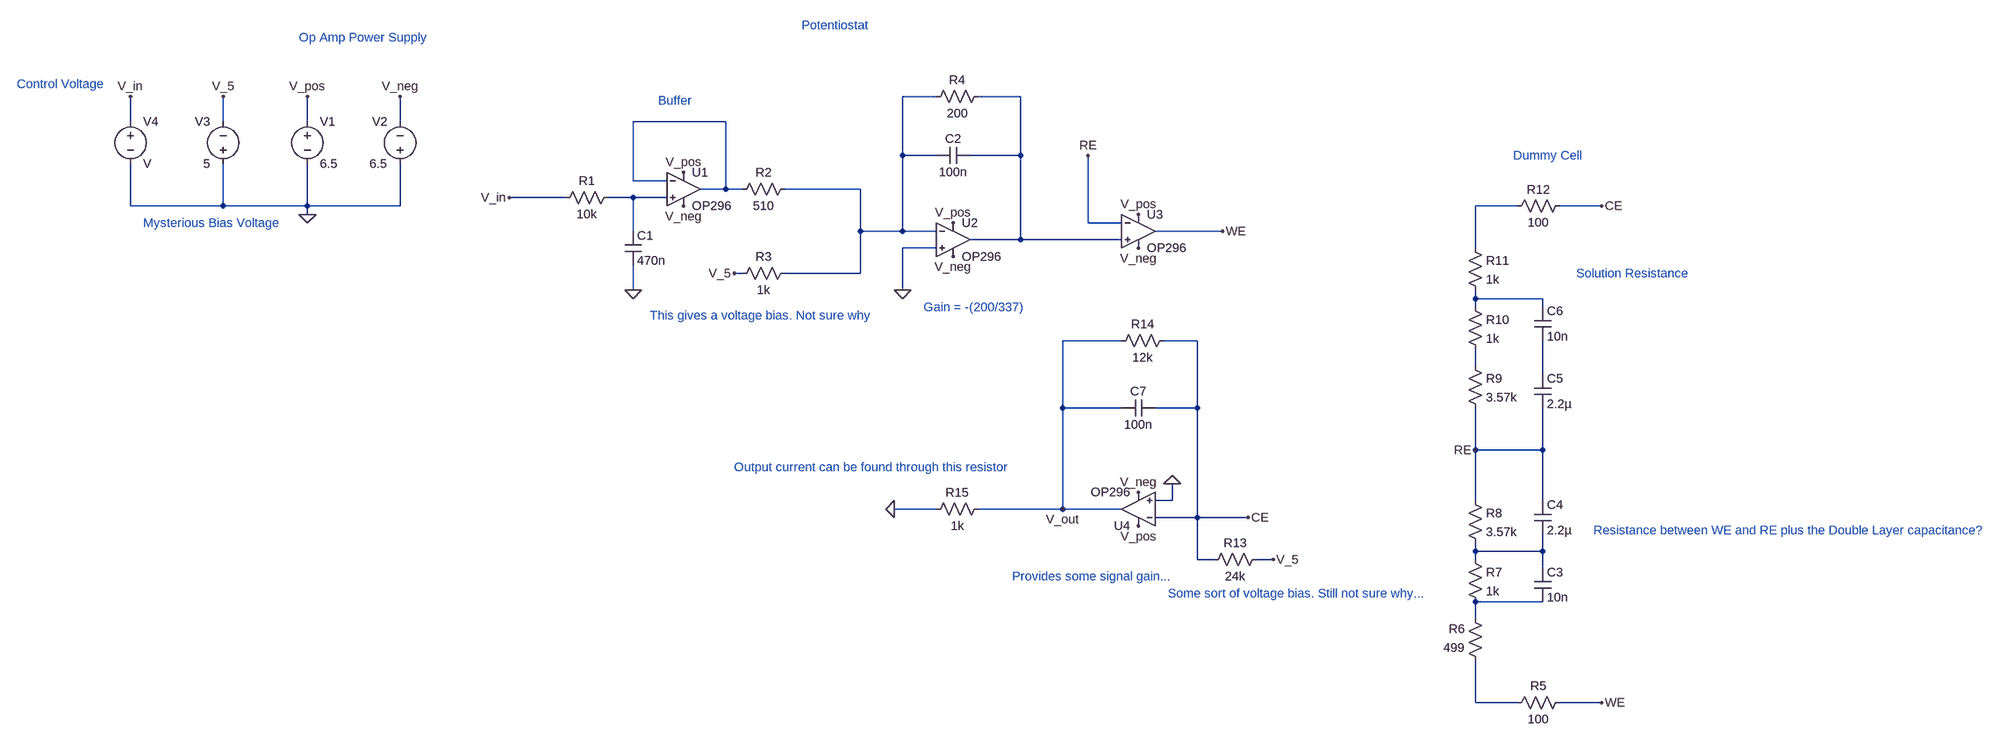
[diagram p0: schematic ECHM_potentiostat_1.asc]
ECHM_potentiostat_1.asc, the LTspice schematic file:
Version 4
SHEET 1 2912 972
WIRE 848 -240 784 -240
WIRE 1008 -240 928 -240
WIRE -816 -192 -816 -240
WIRE -640 -192 -640 -240
WIRE -480 -192 -480 -240
WIRE -304 -192 -304 -240
WIRE 448 -192 272 -192
WIRE 784 -128 784 -240
WIRE 848 -128 784 -128
WIRE 1008 -128 1008 -240
WIRE 1008 -128 912 -128
WIRE 272 -80 272 -192
WIRE 336 -80 272 -80
WIRE 448 -64 448 -192
WIRE 448 -64 400 -64
WIRE 480 -64 448 -64
WIRE 704 -64 560 -64
WIRE 144 -48 32 -48
WIRE 272 -48 224 -48
WIRE 336 -48 272 -48
WIRE -816 -32 -816 -112
WIRE -640 -32 -640 -112
WIRE -640 -32 -816 -32
WIRE -480 -32 -480 -112
WIRE -480 -32 -640 -32
WIRE -304 -32 -304 -112
WIRE -304 -32 -480 -32
WIRE 1952 -32 1872 -32
WIRE 2112 -32 2032 -32
WIRE -480 -16 -480 -32
WIRE 1136 0 1136 -128
WIRE 1200 0 1136 0
WIRE 272 16 272 -48
WIRE 704 16 704 -64
WIRE 784 16 784 -128
WIRE 784 16 704 16
WIRE 848 16 784 16
WIRE 1392 16 1264 16
WIRE 1008 32 1008 -128
WIRE 1008 32 912 32
WIRE 1200 32 1008 32
WIRE 848 48 784 48
WIRE 1872 48 1872 -32
WIRE 480 96 464 96
WIRE 704 96 704 16
WIRE 704 96 560 96
WIRE 272 128 272 80
WIRE 784 128 784 48
WIRE 1872 144 1872 128
WIRE 2000 144 1872 144
WIRE 1872 160 1872 144
WIRE 2000 160 2000 144
WIRE 1200 224 1088 224
WIRE 1344 224 1280 224
WIRE 1872 272 1872 240
WIRE 2000 288 2000 224
WIRE 1088 352 1088 224
WIRE 1200 352 1088 352
WIRE 1344 352 1344 224
WIRE 1344 352 1264 352
WIRE 1872 432 1872 352
WIRE 2000 432 2000 352
WIRE 2000 432 1872 432
WIRE 1296 528 1296 496
WIRE 1296 528 1264 528
WIRE 1872 528 1872 432
WIRE 2000 528 2000 432
WIRE 848 544 768 544
WIRE 1088 544 1088 352
WIRE 1088 544 928 544
WIRE 1200 544 1088 544
WIRE 1344 560 1344 352
WIRE 1344 560 1264 560
WIRE 1440 560 1344 560
WIRE 1872 624 1872 608
WIRE 2000 624 2000 592
WIRE 2000 624 1872 624
WIRE 1344 640 1344 560
WIRE 1376 640 1344 640
WIRE 1488 640 1456 640
WIRE 1872 640 1872 624
WIRE 2000 656 2000 624
WIRE 2000 720 1872 720
WIRE 1872 752 1872 720
WIRE 1872 912 1872 832
WIRE 1952 912 1872 912
WIRE 2112 912 2032 912
FLAG 32 -48 V_in
FLAG 272 128 0
FLAG -480 -240 V_pos
FLAG -304 -240 V_neg
FLAG 368 -32 V_neg
FLAG 368 -96 V_pos
FLAG 464 96 V_5
FLAG -640 -240 V_5
FLAG -480 -16 0
FLAG 880 0 V_pos
FLAG 880 64 V_neg
FLAG 784 128 0
FLAG 1232 -16 V_pos
FLAG 1232 48 V_neg
FLAG 1136 -128 RE
FLAG 1392 16 WE
FLAG 2112 912 WE
FLAG 2112 -32 CE
FLAG 1872 432 RE
FLAG 1232 576 V_pos
FLAG 1232 512 V_neg
FLAG 1488 640 V_5
FLAG 1440 560 CE
FLAG 768 544 0
FLAG -816 -240 V_in
FLAG 1088 544 V_out
FLAG 1296 496 0
SYMBOL res 240 -64 R90
WINDOW 0 0 56 VBottom 2
WINDOW 3 32 56 VTop 2
SYMATTR InstName R1
SYMATTR Value 10k
SYMBOL OpAmps\\OP296 368 -128 R0
SYMATTR InstName U1
SYMBOL cap 256 16 R0
SYMATTR InstName C1
SYMATTR Value 470n
SYMBOL voltage -480 -208 R0
WINDOW 123 0 0 Left 0
WINDOW 39 0 0 Left 0
SYMATTR InstName V1
SYMATTR Value 6.5
SYMBOL voltage -304 -96 R180
WINDOW 0 24 96 Left 2
WINDOW 3 24 16 Left 2
WINDOW 123 0 0 Left 0
WINDOW 39 0 0 Left 0
SYMATTR InstName V2
SYMATTR Value 6.5
SYMBOL res 576 -80 R90
WINDOW 0 0 56 VBottom 2
WINDOW 3 32 56 VTop 2
SYMATTR InstName R2
SYMATTR Value 510
SYMBOL res 576 80 R90
WINDOW 0 0 56 VBottom 2
WINDOW 3 32 56 VTop 2
SYMATTR InstName R3
SYMATTR Value 1k
SYMBOL voltage -640 -96 R180
WINDOW 0 24 96 Left 2
WINDOW 3 24 16 Left 2
WINDOW 123 0 0 Left 0
WINDOW 39 0 0 Left 0
SYMATTR InstName V3
SYMATTR Value 5
SYMBOL OpAmps\\OP296 880 -32 R0
SYMATTR InstName U2
SYMBOL cap 912 -144 R90
WINDOW 0 0 32 VBottom 2
WINDOW 3 32 32 VTop 2
SYMATTR InstName C2
SYMATTR Value 100n
SYMBOL res 944 -256 R90
WINDOW 0 0 56 VBottom 2
WINDOW 3 32 56 VTop 2
SYMATTR InstName R4
SYMATTR Value 200
SYMBOL OpAmps\\OP296 1232 -48 R0
SYMATTR InstName U3
SYMBOL res 2048 896 R90
WINDOW 0 0 56 VBottom 2
WINDOW 3 32 56 VTop 2
SYMATTR InstName R5
SYMATTR Value 100
SYMBOL res 1888 848 R180
WINDOW 0 36 76 Left 2
WINDOW 3 36 40 Left 2
SYMATTR InstName R6
SYMATTR Value 499
SYMBOL res 1856 624 R0
SYMATTR InstName R7
SYMATTR Value 1k
SYMBOL res 1856 512 R0
SYMATTR InstName R8
SYMATTR Value 3.57k
SYMBOL res 1856 256 R0
SYMATTR InstName R9
SYMATTR Value 3.57k
SYMBOL res 1856 144 R0
SYMATTR InstName R10
SYMATTR Value 1k
SYMBOL res 1856 32 R0
SYMATTR InstName R11
SYMATTR Value 1k
SYMBOL cap 1984 656 R0
SYMATTR InstName C3
SYMATTR Value 10n
SYMBOL cap 1984 528 R0
SYMATTR InstName C4
SYMATTR Value 2.2µ
SYMBOL cap 1984 288 R0
SYMATTR InstName C5
SYMATTR Value 2.2µ
SYMBOL cap 1984 160 R0
SYMATTR InstName C6
SYMATTR Value 10n
SYMBOL res 2048 -48 R90
WINDOW 0 0 56 VBottom 2
WINDOW 3 32 56 VTop 2
SYMATTR InstName R12
SYMATTR Value 100
SYMBOL OpAmps\\OP296 1232 608 R180
SYMATTR InstName U4
SYMBOL res 1472 624 R90
WINDOW 0 0 56 VBottom 2
WINDOW 3 32 56 VTop 2
SYMATTR InstName R13
SYMATTR Value 24k
SYMBOL cap 1264 336 R90
WINDOW 0 0 32 VBottom 2
WINDOW 3 32 32 VTop 2
SYMATTR InstName C7
SYMATTR Value 100n
SYMBOL res 1296 208 R90
WINDOW 0 0 56 VBottom 2
WINDOW 3 32 56 VTop 2
SYMATTR InstName R14
SYMATTR Value 12k
SYMBOL res 944 528 R90
WINDOW 0 0 56 VBottom 2
WINDOW 3 32 56 VTop 2
SYMATTR InstName R15
SYMATTR Value 1k
SYMBOL voltage -816 -208 R0
SYMATTR InstName V4
TEXT 1944 -128 Left 2 ;Dummy Cell
TEXT 592 -376 Left 2 ;Potentiostat
TEXT 320 -232 Left 2 ;Buffer
TEXT 304 176 Left 2 ;This gives a voltage bias. Not sure why
TEXT 824 160 Left 2 ;Gain = -(200/337)
TEXT 2064 96 Left 2 ;Solution Resistance
TEXT 2096 584 Left 2 ;Resistance between WE and RE plus the Double Layer capacitance?
TEXT 1288 704 Left 2 ;Some sort of voltage bias. Still not sure why...
TEXT 992 672 Left 2 ;Provides some signal gain...
TEXT 464 464 Left 2 ;Output current can be found through this resistor
TEXT -496 -352 Left 2 ;Op Amp Power Supply
TEXT -1032 -264 Left 2 ;Control Voltage
TEXT -792 0 Left 2 ;Mysterious Bias Voltage

The netlist it stands for:
* ECHM_potentiostat_1.asc
R1 N004 V_in 10k
XU1 N004 N003 V_pos V_neg N003 OP296  ; pins In+ In- V+ V- OUT
C1 N004 0 470n
V1 V_pos 0 6.5
V2 0 V_neg 6.5
R2 N001 N003 510
R3 N001 V_5 1k
V3 0 V_5 5
XU2 0 N001 V_pos V_neg N002 OP296  ; pins In+ In- V+ V- OUT
C2 N002 N001 100n
R4 N002 N001 200
XU3 N002 RE V_pos V_neg WE OP296  ; pins In+ In- V+ V- OUT
R5 WE N011 100
R6 N011 N010 499
R7 N009 N010 1k
R8 RE N009 3.57k
R9 N007 RE 3.57k
R10 N006 N007 1k
R11 N005 N006 1k
C3 N009 N010 10n
C4 RE N009 2.2µ
C5 N008 RE 2.2µ
C6 N006 N008 10n
R12 CE N005 100
XU4 0 CE V_pos V_neg V_out OP296  ; pins In+ In- V+ V- OUT
R13 V_5 CE 24k
C7 CE V_out 100n
R14 CE V_out 12k
R15 V_out 0 1k
V4 V_in 0 V
* Dummy Cell
* Potentiostat
* Buffer
* This gives a voltage bias. Not sure why
* Gain = -(200/337)
* Solution Resistance
* Resistance between WE and RE plus the Double Layer capacitance?
* Some sort of voltage bias. Still not sure why...
* Provides some signal gain...
* Output current can be found through this resistor
* Op Amp Power Supply
* Control Voltage
* Mysterious Bias Voltage
.backanno
.end